# Altium project TE0890.PrjPCB
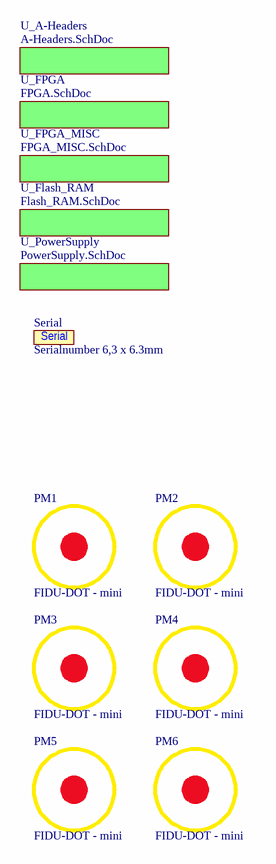
[diagram p0: TE0890.SchDoc]
ProjectName: TE0890; Revision: 01
6 sheets, 94 parts. Net scope: global (net labels, ports and power ports of the same name join across sheets).
Board file: TE0890.PcbDoc
Sheets:
  TE0890.SchDoc
    U_A-Headers = A-Headers.SchDoc
    U_PowerSupply = PowerSupply.SchDoc
    U_FPGA = FPGA.SchDoc
    U_FPGA_MISC = FPGA_MISC.SchDoc
    U_Flash_RAM = Flash_RAM.SchDoc

## Sheet TE0890.SchDoc: TE0890 - S7Mini
size A4; Organization: Trenz Electronic GmbH; DocumentNumber: TE0890; Revision: 01; SheetNumber: 1; SheetTotal: 6; Date: 2018-08-06; Author: Vitali Tsiukala; CompanyName: Trenz Electronic GmbH; DrawnBy: Vitali Tsiukala; Engineer: Vitali Tsiukala; ProjectName: TE0723 Arduino

### Parts
PM1  FIDU-DOT - mini  [FIDU-DOT - mini]
PM2  FIDU-DOT - mini  [FIDU-DOT - mini]
PM3  FIDU-DOT - mini  [FIDU-DOT - mini]
PM4  FIDU-DOT - mini  [FIDU-DOT - mini]
PM5  FIDU-DOT - mini  [FIDU-DOT - mini]
PM6  FIDU-DOT - mini  [FIDU-DOT - mini]
Serial  Serialnumber 6,3 x 6.3mm  [Serial_6.3x6.3mm]  (no BOM)

### Sub-sheets
U_A-Headers = A-Headers.SchDoc: no entries
U_Flash_RAM = Flash_RAM.SchDoc: no entries
U_FPGA = FPGA.SchDoc: no entries
U_FPGA_MISC = FPGA_MISC.SchDoc: no entries
U_PowerSupply = PowerSupply.SchDoc: no entries

### Notes on the sheet
- Title:
- Number:
- Rev.
- Date:
- A4
- Copyright:
- Page
- of
- Filename:

### Library data of the parts
PM1-PM6 = 27037: FIDU-DOT - MINI 0.5mm; AN: 27037; Mixed: FIDU
Serial = 26753: AN: 26753; H-ART: 39068; Mixed: MECH

## Sheet A-Headers.SchDoc: TE0890 - S7Mini
size A4; Organization: Trenz Electronic GmbH; DocumentNumber: TE0890; Revision: 01; SheetNumber: 2; SheetTotal: 6; Date: 2018-08-06; Author: Vitali Tsiukala; CompanyName: Trenz Electronic GmbH; DrawnBy: Vitali Tsiukala; Engineer: Vitali Tsiukala; ProjectName: TE0723 Arduino
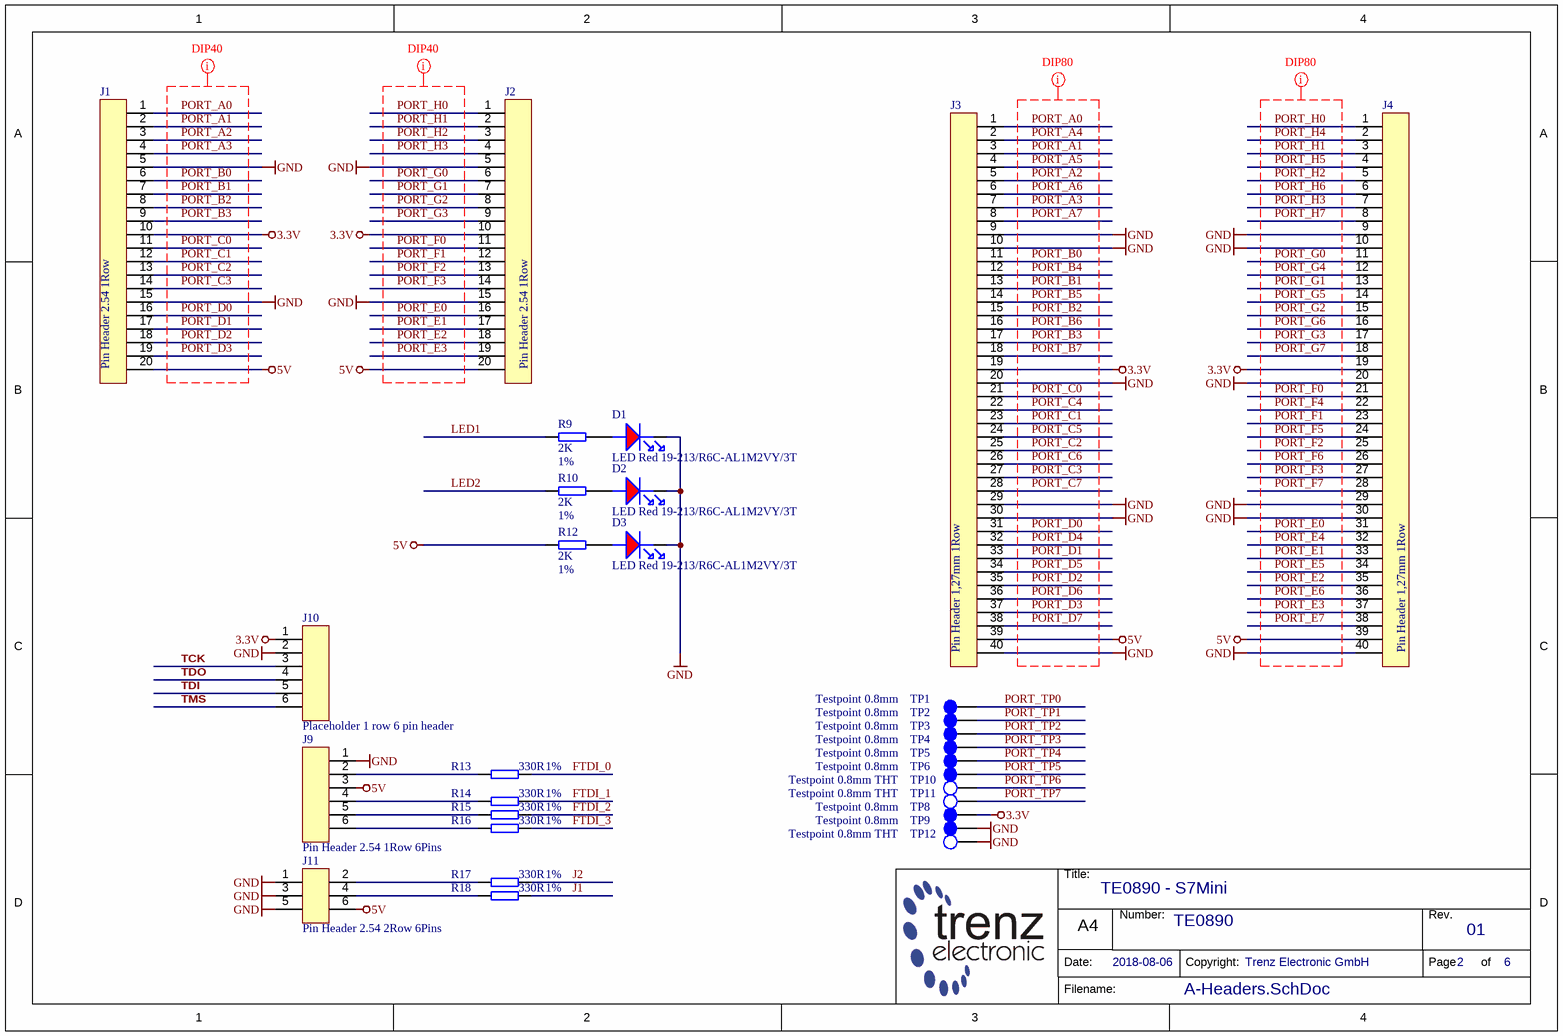
[diagram p1: A-Headers.SchDoc]

### Parts
D1  LED Red 19-213/R6C-AL1M2VY/3T  [LEDC1608X55N_RED]
D2  LED Red 19-213/R6C-AL1M2VY/3T  [LEDC1608X55N_RED]
D3  LED Red 19-213/R6C-AL1M2VY/3T  [LEDC1608X55N_RED]
J1  Pin Header 2.54 1Row  [STIFTLEISTE2_54 OG 1R-20]
J2  Pin Header 2.54 1Row  [STIFTLEISTE2_54 OG 1R-20]
J3  Pin Header 1,27mm 1Row  [STIFTLEISTE1_27 OG 1R-40]
J4  Pin Header 1,27mm 1Row  [STIFTLEISTE1_27 OG 1R-40]
J9  Pin Header 2.54 1Row 6Pins  [STIFTLEISTE2_54 OG 1R-6]
J10  Placeholder 1 row 6 pin header  [STIFTLEISTE2_54 OG 1R-6V]
J11  Pin Header 2.54 2Row 6Pins  [STIFTLEISTE2_54 OG 2R-6]
R9  2K  Tolerance: 1%  [RESC1005X40N]
R10  2K  Tolerance: 1%  [RESC1005X40N]
R12  2K  Tolerance: 1%  [RESC1005X40N]
R13  330R  Tolerance: 1%  [RESC1005X40N]
R14  330R  Tolerance: 1%  [RESC1005X40N]
R15  330R  Tolerance: 1%  [RESC1005X40N]
R16  330R  Tolerance: 1%  [RESC1005X40N]
R17  330R  Tolerance: 1%  [RESC1005X40N]
R18  330R  Tolerance: 1%  [RESC1005X40N]
TP1  Testpoint 0.8mm  [TP_0.8mm]
TP2  Testpoint 0.8mm  [TP_0.8mm]
TP3  Testpoint 0.8mm  [TP_0.8mm]
TP4  Testpoint 0.8mm  [TP_0.8mm]
TP5  Testpoint 0.8mm  [TP_0.8mm]
TP6  Testpoint 0.8mm  [TP_0.8mm]
TP8  Testpoint 0.8mm  [TP_0.8mm]
TP9  Testpoint 0.8mm  [TP_0.8mm]
TP10  Testpoint 0.8mm THT  [TP_0.8mm_THT]
TP11  Testpoint 0.8mm THT  [TP_0.8mm_THT]
TP12  Testpoint 0.8mm THT  [TP_0.8mm_THT]

### Nets
3.3V: J1.10 J2.10 J3.19 J4.19 J10.1 TP8.1
5V: J1.20 J2.20 J3.39 J4.39 J9.3 J11.6 R12.1
GND: D1.K D2.K D3.K J1.5 J1.15 J2.5 J2.15 J3.9 J3.10 J3.20 J3.29 J3.30 J3.40 J4.9 J4.10 J4.20 J4.29 J4.30 J4.40 J9.1 J10.2 J11.1 J11.3 J11.5 TP9.1 TP12.1
FTDI_0: R13.2
FTDI_1: R14.2
FTDI_2: R15.2
FTDI_3: R16.2
J1: R18.2
J2: R17.2
LED1: R9.1
LED2: R10.1
PORT_A0: J1.1 J3.1
PORT_A1: J1.2 J3.3
PORT_A2: J1.3 J3.5
PORT_A3: J1.4 J3.7
PORT_A4: J3.2
PORT_A5: J3.4
PORT_A6: J3.6
PORT_A7: J3.8
PORT_B0: J1.6 J3.11
PORT_B1: J1.7 J3.13
PORT_B2: J1.8 J3.15
PORT_B3: J1.9 J3.17
PORT_B4: J3.12
PORT_B5: J3.14
PORT_B6: J3.16
PORT_B7: J3.18
PORT_C0: J1.11 J3.21
PORT_C1: J1.12 J3.23
PORT_C2: J1.13 J3.25
PORT_C3: J1.14 J3.27
PORT_C4: J3.22
PORT_C5: J3.24
PORT_C6: J3.26
PORT_C7: J3.28
PORT_D0: J1.16 J3.31
PORT_D1: J1.17 J3.33
PORT_D2: J1.18 J3.35
PORT_D3: J1.19 J3.37
PORT_D4: J3.32
PORT_D5: J3.34
PORT_D6: J3.36
PORT_D7: J3.38
PORT_E0: J2.16 J4.31
PORT_E1: J2.17 J4.33
PORT_E2: J2.18 J4.35
PORT_E3: J2.19 J4.37
PORT_E4: J4.32
PORT_E5: J4.34
PORT_E6: J4.36
PORT_E7: J4.38
PORT_F0: J2.11 J4.21
PORT_F1: J2.12 J4.23
PORT_F2: J2.13 J4.25
PORT_F3: J2.14 J4.27
PORT_F4: J4.22
PORT_F5: J4.24
PORT_F6: J4.26
PORT_F7: J4.28
PORT_G0: J2.6 J4.11
PORT_G1: J2.7 J4.13
PORT_G2: J2.8 J4.15
PORT_G3: J2.9 J4.17
PORT_G4: J4.12
PORT_G5: J4.14
PORT_G6: J4.16
PORT_G7: J4.18
PORT_H0: J2.1 J4.1
PORT_H1: J2.2 J4.3
PORT_H2: J2.3 J4.5
PORT_H3: J2.4 J4.7
PORT_H4: J4.2
PORT_H5: J4.4
PORT_H6: J4.6
PORT_H7: J4.8
PORT_TP0: TP1.1
PORT_TP1: TP2.1
PORT_TP2: TP3.1
PORT_TP3: TP4.1
PORT_TP4: TP5.1
PORT_TP5: TP6.1
PORT_TP6: TP10.1
PORT_TP7: TP11.1
TCK: J10.3
TDI: J10.5
TDO: J10.4
TMS: J10.6
NetD1_A: D1.A R9.2
NetD2_A: D2.A R10.2
NetD3_A: D3.A R12.2
NetJ9_2: J9.2 R13.1
NetJ9_4: J9.4 R14.1
NetJ9_5: J9.5 R15.1
NetJ9_6: J9.6 R16.1
NetJ11_2: J11.2 R17.1
NetJ11_4: J11.4 R18.1

### Layout directives
net class DIP40: PORT_A0, PORT_A1, PORT_A2, PORT_A3, PORT_B0, PORT_B1, PORT_B2, PORT_B3, PORT_C0, PORT_C1, PORT_C2, PORT_C3, PORT_D0, PORT_D1, PORT_D2, PORT_D3, PORT_E0, PORT_E1, PORT_E2, PORT_E3, PORT_F0, PORT_F1, PORT_F2, PORT_F3, PORT_G0, PORT_G1, PORT_G2, PORT_G3, PORT_H0, PORT_H1, PORT_H2, PORT_H3
net class DIP80: PORT_A0, PORT_A1, PORT_A2, PORT_A3, PORT_A4, PORT_A5, PORT_A6, PORT_A7, PORT_B0, PORT_B1, PORT_B2, PORT_B3, PORT_B4, PORT_B5, PORT_B6, PORT_B7, PORT_C0, PORT_C1, PORT_C2, PORT_C3, PORT_C4, PORT_C5, PORT_C6, PORT_C7, PORT_D0, PORT_D1, PORT_D2, PORT_D3, PORT_D4, PORT_D5, PORT_D6, PORT_D7, PORT_E0, PORT_E1, PORT_E2, PORT_E3, PORT_E4, PORT_E5, PORT_E6, PORT_E7, PORT_F0, PORT_F1, PORT_F2, PORT_F3, PORT_F4, PORT_F5, PORT_F6, PORT_F7, PORT_G0, PORT_G1, PORT_G2, PORT_G3, PORT_G4, PORT_G5, PORT_G6, PORT_G7, PORT_H0, PORT_H1, PORT_H2, PORT_H3, PORT_H4, PORT_H5, PORT_H6, PORT_H7

### Notes on the sheet
- Title:
- Number:
- Rev.
- Date:
- A4
- Copyright:
- Page
- of
- Filename:

### Library data of the parts
D1-D3 = 28261: Chip LED 0603 Briliant Red; AN: 28261; Mixed: SMT; Case: 1608 (0603); HelpURL: b:\AD\adlib\datasheet\19-213-R6C\; H-ART: 19-213/R6C-AL1M2VY/3T
J1 J2 = 29193: Stiftleiste versetzt 1-reihig, 20pol.; AN: 29193; Mixed: THT; H-ART: 943-12-020-00; Temperature-Range: -40/+125; HelpURL: b:\AD\adlib\datasheet\W+P_943_944_945\
J3 J4 = 29194: Stiftleiste versetzt 1-reihig, 40pol.; AN: 29194; Mixed: THT; Temperature-Range: -40/+125; H-ART: 702-40-40-00; HelpURL: b:\AD\adlib\datasheet\W+P_702_703\
J9 = 28042: Stiftleiste gerade 1-reihig, 6pol; AN: 28042; Mixed: THT
J10 = 22911: Stiftleiste versetzt 1-reihig, 6pol.; AN: 22911; Mixed: THT; Trenz-Stock: Yes
J11 = 22334: Stiftleiste gerade 2-reihig, 6pol.; AN: 22334; Mixed: THT; Trenz-Stock: Yes
R9 R10 R12 = 25073: WID SMD 2K 1% 0,063W; AN: 25073; Mixed: SMT; H-ART: RC0402FR-072KL; Case: 1005 (0402); Technology: TK100; Value: 2K
R13-R18 = 22762: WID SMD 330R 1% 0,063W  BF 1005 (0402); AN: 22762; Mixed: SMT; Value: 330; Preferred: Yes; H-ART: RC0402FR-13330RL; Case: 1005 (0402); Technology: TK100
TP1-TP6 TP8 TP9 = 26289: AN: 26289; Mixed: MECH
TP10-TP12 = 27481: Testpoint 0.8mm TH; AN: 27481

## Sheet PowerSupply.SchDoc: TE0890 - S7Mini
size A4; PageSetup: Record=PageOptions|CenterHorizontal=True|CenterVertical=True|PrintScale=0.96|XCorrection=1.00|YCorrection=1.00|PrintKind=0|BorderSize=5000000|LeftOffset=0|BottomOffset=0|Orientation=2|PaperLength=1000|PaperWidth=1000|Scale=100|PaperSource=7|PrintQuality=-4|MediaType=1|DitherType=10|PaperKind=A4|PrintScaleMode=1; Organization: Trenz Electronic GmbH; DocumentNumber: TE0890; Revision: 01; SheetNumber: 6; SheetTotal: 6; Date: 2018-08-06; Author: Vitali Tsiukala; CompanyName: Trenz Electronic GmbH; DrawnBy: Vitali Tsiukala; Engineer: Vitali Tsiukala; ProjectName: TE0723 Arduino
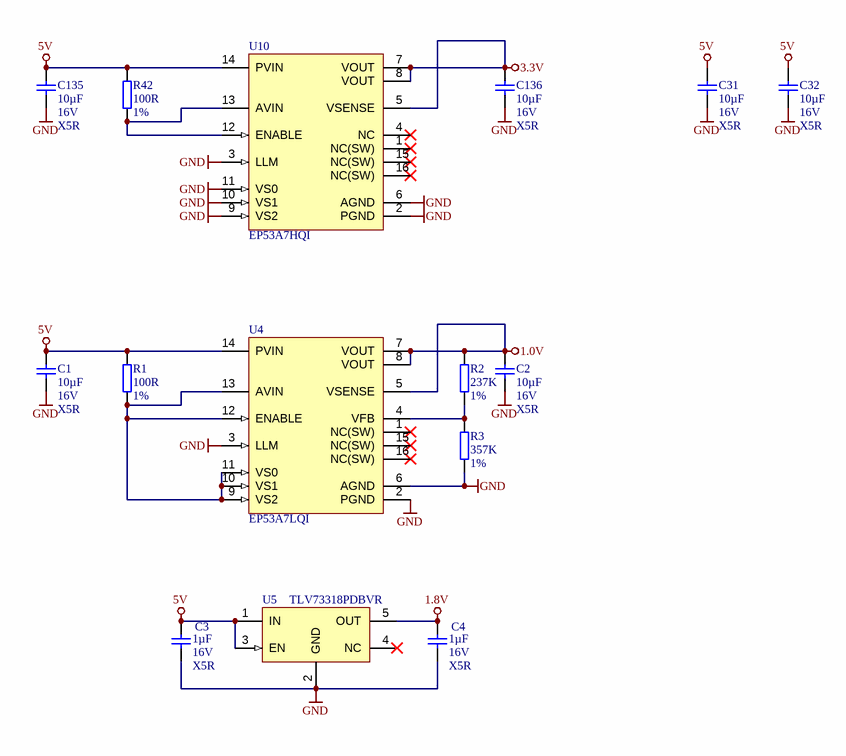
[diagram p2: PowerSupply.SchDoc]

### Parts
C1  10µF  Voltage: 16V  Technology: X5R  [CAPC1608X90N]
C2  10µF  Voltage: 16V  Technology: X5R  [CAPC1608X90N]
C3  1µF  Voltage: 16V  Technology: X5R  [CAPC1005X55N]
C4  1µF  Voltage: 16V  Technology: X5R  [CAPC1005X55N]
C31  10µF  Voltage: 16V  Technology: X5R  [CAPC1608X90N]
C32  10µF  Voltage: 16V  Technology: X5R  [CAPC1608X90N]
C135  10µF  Voltage: 16V  Technology: X5R  [CAPC1608X90N]
C136  10µF  Voltage: 16V  Technology: X5R  [CAPC1608X90N]
R1  100R  Tolerance: 1%  [RESC1005X40N]
R2  237K  Tolerance: 1%  [RESC1005X40N]
R3  357K  Tolerance: 1%  [RESC1005X40N]
R42  100R  Tolerance: 1%  [RESC1005X40N]
U4  EP53A7LQI  [EP53F8QI]
U5  TLV73318PDBVR  [SOT95P280X145-5N]
U10  EP53A7HQI  [EP53F8QI]

### Nets
1.0V: C2.2 R2.1 U4.5(VSENSE) U4.7(VOUT) U4.8(VOUT)
1.8V: C4.1 U5.5(OUT)
3.3V: C136.2 U10.5(VSENSE) U10.7(VOUT) U10.8(VOUT)
5V: C1.2 C3.1 C31.2 C32.2 C135.2 R1.1 R42.1 U4.14(PVIN) U5.1(IN) U5.3(EN) U10.14(PVIN)
GND: C1.1 C2.1 C3.2 C4.2 C31.1 C32.1 C135.1 C136.1 R3.2 U4.2(PGND) U4.3(LLM) U4.6(AGND) U5.2(GND) U10.2(PGND) U10.3(LLM) U10.6(AGND) U10.9(VS2) U10.10(VS1) U10.11(VS0)
NetR1_2: R1.2 U4.9(VS2) U4.10(VS1) U4.11(VS0) U4.12(ENABLE) U4.13(AVIN)
NetR2_2: R2.2 R3.1 U4.4(VFB)
NetR42_2: R42.2 U10.12(ENABLE) U10.13(AVIN)

Not connected (* = marked no-connect by the designer): U4 1(NC(SW))* 15(NC(SW))* 16(NC(SW))*; U5 4(NC)*; U10 1(NC(SW))* 4(NC)* 15(NC(SW))* 16(NC(SW))*

### Notes on the sheet
- Title:
- Number:
- Rev.
- Date:
- A4
- Copyright:
- Page
- of
- Filename:

### Library data of the parts
C1 C2 C31 C32 C135 C136 = 25341: KON 10µF 16V X5R 20% SMD BF 1608 (0603); AN: 25341; Value: 10u; Mixed: SMT; Preferred: Yes; Temperature-Range: -55/+85; Case: 1608 (0603); Tolerance: 20%
C3 C4 = 26579: KON 1µF 16V X5R 10% SMD BF 1005 (0402); AN: 26579; Mixed: SMT; Value: 1u; Temperature-Range: -55/+85; Case: 1005 (0402); Tolerance: 10%
R1 R42 = 22507: WID SMD 100R 1% 0,063W  BF 1005 (0402); AN: 22507; Mixed: SMT; Value: 100; Preferred: Yes; H-ART: RC0402FR-13100RL; Case: 1005 (0402); Technology: TK100
R2 = 24549: WID SMD 237K 1% 0,063W; AN: 24549; Mixed: SMT; Preferred: Yes; H-ART: RC0402FR-07237KL; Case: 1005 (0402); Technology: TK100; Value: 237K
R3 = 25437: WID SMD 357K 1% 0,063W; AN: 25437; Mixed: SMT; Preferred: Yes; Case: 1005 (0402); Technology: TK100; Value: 357k
U4 = 28280: AN: 28280; Mixed: SMT; Trenz-Stock: Yes; Case: QFN16; HelpURL: B:\AD\adlib\datasheet\EP53A7HQI; H-ART: EP53A7LQI; Preferred: Yes
U5 = 28418: TLV73318PDBV; AN: 28418; Voltage: 1.8V; Mixed: SMT; Case: SOT23-3; HelpURL: b:\AD\adlib\datasheet\TLV733xx\; H-ART: TLV73318PDBV
U10 = 27996: AN: 27996; Mixed: SMT; Trenz-Stock: Yes; Case: QFN16; HelpURL: B:\AD\adlib\datasheet\EP53A7HQI; Preferred: Yes; H-ART: EP53A7HQI

## Sheet FPGA.SchDoc: TE0890 - S7Mini
size A4; Organization: Trenz Electronic GmbH; DocumentNumber: TE0890; Revision: 01; SheetNumber: 3; SheetTotal: 6; Date: 2018-08-06; Author: Vitali Tsiukala; CompanyName: Trenz Electronic GmbH; DrawnBy: Vitali Tsiukala; Engineer: Vitali Tsiukala; ProjectName: TE0723 Arduino
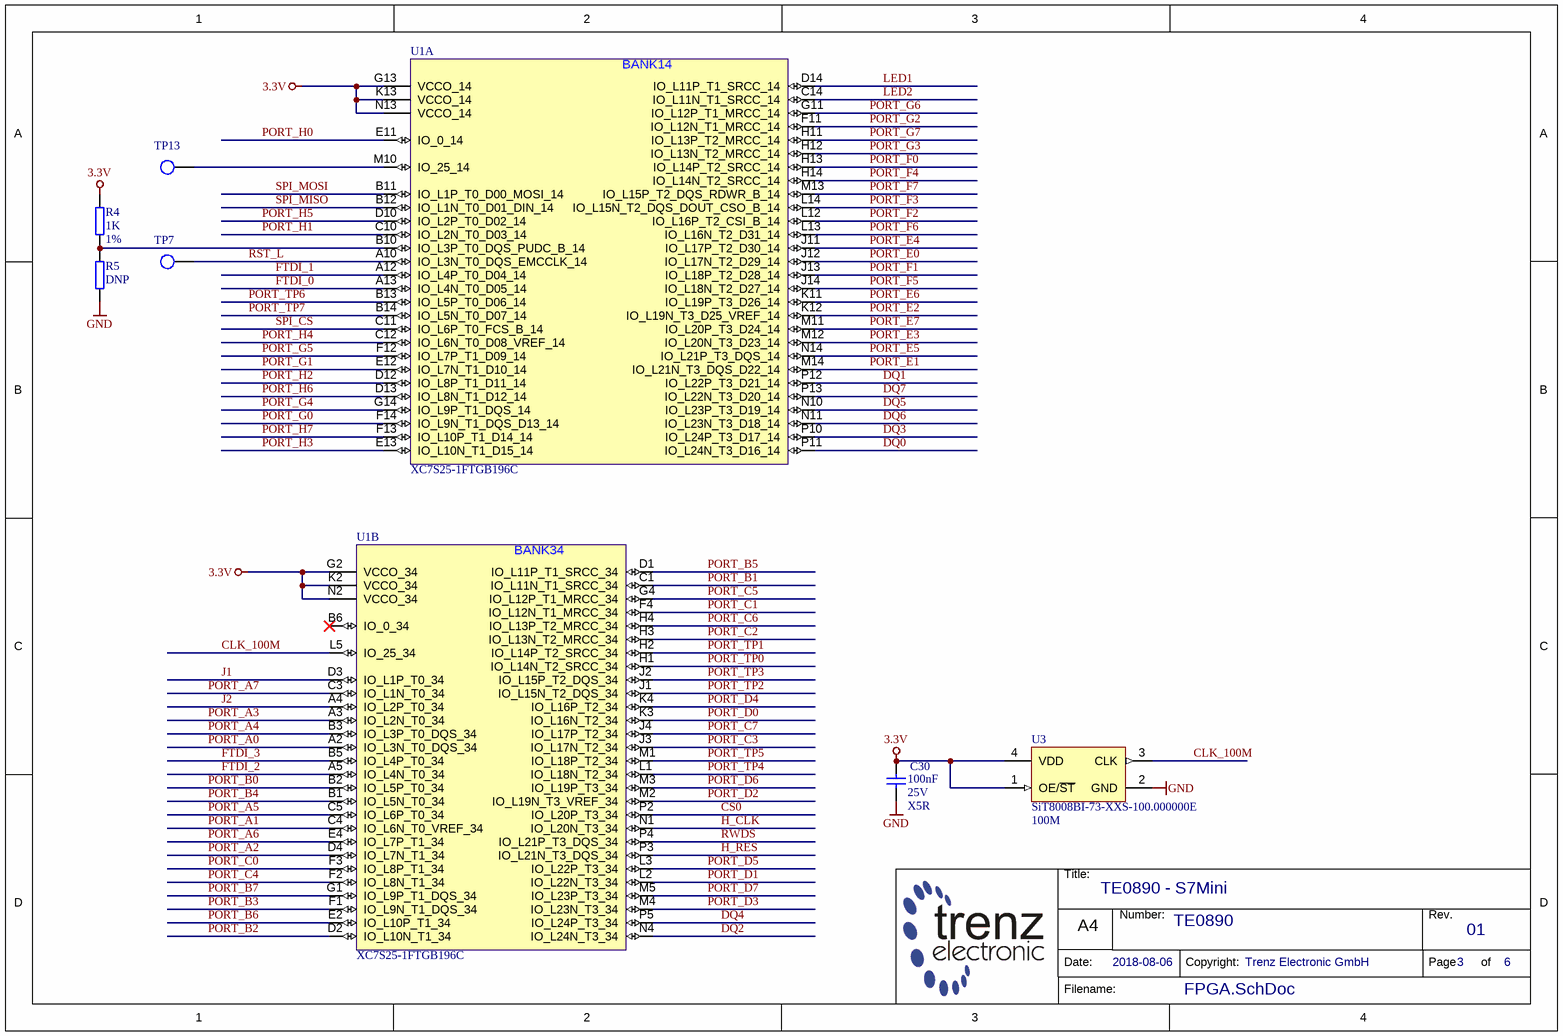
[diagram p3: FPGA.SchDoc]

### Parts
C30  100nF  Voltage: 25V  Technology: X5R  [CAPC1005X55N]
R4  1K  Tolerance: 1%  [RESC1005X40N]
R5  DNP  [RESC1005X40N]  (no BOM)
TP7  Testpoint 0.8mm THT  [TP_0.8mm_THT]  (value not drawn)
TP13  Testpoint 0.8mm THT  [TP_0.8mm_THT]  (value not drawn)
U1  XC7S25-1FTGB196C  [BGA196C100P14X14_1500X1500X155B50N]  (parts A,B of 5)
U3  SiT8008BI-73-XXS-100.000000E  value 100M  [2016]

### Nets
3.3V: C30.1 R4.1 U1.G2(VCCO_34) U1.G13(VCCO_14) U1.K2(VCCO_34) U1.K13(VCCO_14) U1.N2(VCCO_34) U1.N13(VCCO_14) U3.1(OE/~{ST}) U3.4(VDD)
GND: C30.2 R5.2 U3.2(GND)
CLK_100M: U1.L5(IO_25_34) U3.3(CLK)
CS0: U1.P2(IO_L20P_T3_34)
DQ0: U1.P11(IO_L24N_T3_D16_14)
DQ1: U1.P12(IO_L22P_T3_D21_14)
DQ2: U1.N4(IO_L24N_T3_34)
DQ3: U1.P10(IO_L24P_T3_D17_14)
DQ4: U1.P5(IO_L24P_T3_34)
DQ5: U1.N10(IO_L23P_T3_D19_14)
DQ6: U1.N11(IO_L23N_T3_D18_14)
DQ7: U1.P13(IO_L22N_T3_D20_14)
FTDI_0: U1.A13(IO_L4N_T0_D05_14)
FTDI_1: U1.A12(IO_L4P_T0_D04_14)
FTDI_2: U1.A5(IO_L4N_T0_34)
FTDI_3: U1.B5(IO_L4P_T0_34)
H_CLK: U1.N1(IO_L20N_T3_34)
H_RES: U1.P3(IO_L21N_T3_DQS_34)
J1: U1.D3(IO_L1P_T0_34)
J2: U1.A4(IO_L2P_T0_34)
LED1: U1.D14(IO_L11P_T1_SRCC_14)
LED2: U1.C14(IO_L11N_T1_SRCC_14)
PORT_A0: U1.A2(IO_L3N_T0_DQS_34)
PORT_A1: U1.C4(IO_L6N_T0_VREF_34)
PORT_A2: U1.D4(IO_L7N_T1_34)
PORT_A3: U1.A3(IO_L2N_T0_34)
PORT_A4: U1.B3(IO_L3P_T0_DQS_34)
PORT_A5: U1.C5(IO_L6P_T0_34)
PORT_A6: U1.E4(IO_L7P_T1_34)
PORT_A7: U1.C3(IO_L1N_T0_34)
PORT_B0: U1.B2(IO_L5P_T0_34)
PORT_B1: U1.C1(IO_L11N_T1_SRCC_34)
PORT_B2: U1.D2(IO_L10N_T1_34)
PORT_B3: U1.F1(IO_L9N_T1_DQS_34)
PORT_B4: U1.B1(IO_L5N_T0_34)
PORT_B5: U1.D1(IO_L11P_T1_SRCC_34)
PORT_B6: U1.E2(IO_L10P_T1_34)
PORT_B7: U1.G1(IO_L9P_T1_DQS_34)
PORT_C0: U1.F3(IO_L8P_T1_34)
PORT_C1: U1.F4(IO_L12N_T1_MRCC_34)
PORT_C2: U1.H3(IO_L13N_T2_MRCC_34)
PORT_C3: U1.J3(IO_L17N_T2_34)
PORT_C4: U1.F2(IO_L8N_T1_34)
PORT_C5: U1.G4(IO_L12P_T1_MRCC_34)
PORT_C6: U1.H4(IO_L13P_T2_MRCC_34)
PORT_C7: U1.J4(IO_L17P_T2_34)
PORT_D0: U1.K3(IO_L16N_T2_34)
PORT_D1: U1.L2(IO_L22N_T3_34)
PORT_D2: U1.M2(IO_L19N_T3_VREF_34)
PORT_D3: U1.M4(IO_L23N_T3_34)
PORT_D4: U1.K4(IO_L16P_T2_34)
PORT_D5: U1.L3(IO_L22P_T3_34)
PORT_D6: U1.M3(IO_L19P_T3_34)
PORT_D7: U1.M5(IO_L23P_T3_34)
PORT_E0: U1.J12(IO_L17N_T2_D29_14)
PORT_E1: U1.M14(IO_L21N_T3_DQS_D22_14)
PORT_E2: U1.K12(IO_L19N_T3_D25_VREF_14)
PORT_E3: U1.M12(IO_L20N_T3_D23_14)
PORT_E4: U1.J11(IO_L17P_T2_D30_14)
PORT_E5: U1.N14(IO_L21P_T3_DQS_14)
PORT_E6: U1.K11(IO_L19P_T3_D26_14)
PORT_E7: U1.M11(IO_L20P_T3_D24_14)
PORT_F0: U1.H13(IO_L14P_T2_SRCC_14)
PORT_F1: U1.J13(IO_L18P_T2_D28_14)
PORT_F2: U1.L12(IO_L16P_T2_CSI_B_14)
PORT_F3: U1.L14(IO_L15N_T2_DQS_DOUT_CSO_B_14)
PORT_F4: U1.H14(IO_L14N_T2_SRCC_14)
PORT_F5: U1.J14(IO_L18N_T2_D27_14)
PORT_F6: U1.L13(IO_L16N_T2_D31_14)
PORT_F7: U1.M13(IO_L15P_T2_DQS_RDWR_B_14)
PORT_G0: U1.F14(IO_L9N_T1_DQS_D13_14)
PORT_G1: U1.E12(IO_L7N_T1_D10_14)
PORT_G2: U1.F11(IO_L12N_T1_MRCC_14)
PORT_G3: U1.H12(IO_L13N_T2_MRCC_14)
PORT_G4: U1.G14(IO_L9P_T1_DQS_14)
PORT_G5: U1.F12(IO_L7P_T1_D09_14)
PORT_G6: U1.G11(IO_L12P_T1_MRCC_14)
PORT_G7: U1.H11(IO_L13P_T2_MRCC_14)
PORT_H0: U1.E11(IO_0_14)
PORT_H1: U1.C10(IO_L2N_T0_D03_14)
PORT_H2: U1.D12(IO_L8P_T1_D11_14)
PORT_H3: U1.E13(IO_L10N_T1_D15_14)
PORT_H4: U1.C12(IO_L6N_T0_D08_VREF_14)
PORT_H5: U1.D10(IO_L2P_T0_D02_14)
PORT_H6: U1.D13(IO_L8N_T1_D12_14)
PORT_H7: U1.F13(IO_L10P_T1_D14_14)
PORT_TP0: U1.H1(IO_L14N_T2_SRCC_34)
PORT_TP1: U1.H2(IO_L14P_T2_SRCC_34)
PORT_TP2: U1.J1(IO_L15N_T2_DQS_34)
PORT_TP3: U1.J2(IO_L15P_T2_DQS_34)
PORT_TP4: U1.L1(IO_L18N_T2_34)
PORT_TP5: U1.M1(IO_L18P_T2_34)
PORT_TP6: U1.B13(IO_L5P_T0_D06_14)
PORT_TP7: U1.B14(IO_L5N_T0_D07_14)
RST_L: TP7.1 U1.A10(IO_L3N_T0_DQS_EMCCLK_14)
RWDS: U1.P4(IO_L21P_T3_DQS_34)
SPI_CS: U1.C11(IO_L6P_T0_FCS_B_14)
SPI_MISO: U1.B12(IO_L1N_T0_D01_DIN_14)
SPI_MOSI: U1.B11(IO_L1P_T0_D00_MOSI_14)
NetR4_2: R4.2 R5.1 U1.B10(IO_L3P_T0_DQS_PUDC_B_14)
NetTP13_1: TP13.1 U1.M10(IO_25_14)

Not connected (* = marked no-connect by the designer): U1 B6(IO_0_34)*

### Notes on the sheet
- Title:
- Number:
- Rev.
- Date:
- A4
- Copyright:
- Page
- of
- Filename:
- (in symbol 29276, part A) BANK14
- (in symbol 29276, part B) BANK34

### Library data of the parts
C30 = 22472: KON 100nF 25V X5R ±10% SMD BF 1005 (0402); AN: 22472; Mixed: SMT; Value: 100n; Preferred: Yes; Temperature-Range: -55/+85; Case: 1005 (0402)
R4 = 22752: WID SMD 1K 1% 0,063W  BF 1005 (0402); AN: 22752; Mixed: SMT; Preferred: Yes; H-ART: RC0402FR-071KL; Case: 1005 (0402); Technology: TK100; Value: 1K
R5 = 29416: WID SMD BF 1005 (0402) DNP; AN: 29416; Case: 1005 (0402); Value: DNP
TP7 TP13 = 27481: Testpoint 0.8mm TH; AN: 27481
U1 = 29276: AN: 29276; Mixed: SMT; Temperature-Range: 0/+85; Case: FTGB196; HelpURL: B:\AD\adlib\datasheet\XC7; H-ART: XC7S25-1FTGB196C
U3 = 25961: SiT8008BI-73-XXS-100.000000E MEMS Oszillator 100MHz; AN: 25961; Mixed: SMT; Trenz-Stock: Yes; Case: 2.0  x 1.6mm; HelpURL: B:\AD\adlib\datasheet\SiT8008; Preferred: Yes; H-ART: SiT8008BI-73-XXS-100.000000E

## Sheet FPGA_MISC.SchDoc: TE0890 - S7Mini
size A4; Organization: Trenz Electronic GmbH; DocumentNumber: TE0890; Revision: 01; SheetNumber: 4; SheetTotal: 6; Date: 2018-08-06; Author: Vitali Tsiukala; CompanyName: Trenz Electronic GmbH; DrawnBy: Vitali Tsiukala; Engineer: Vitali Tsiukala; ProjectName: TE0723 Arduino
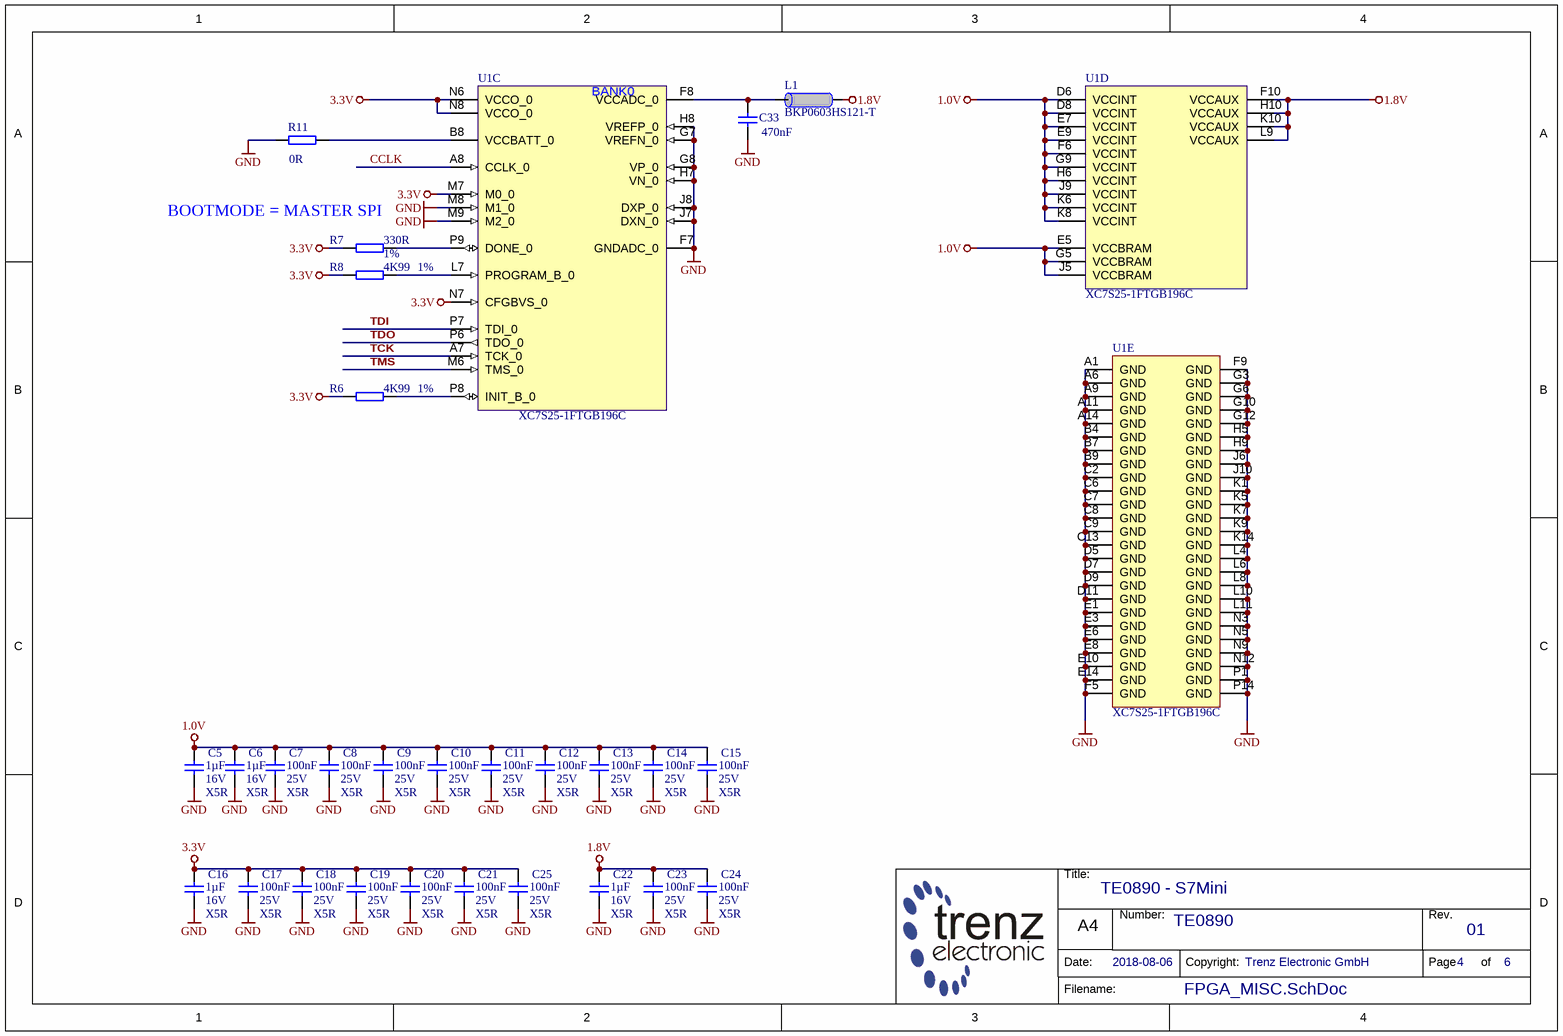
[diagram p4: FPGA_MISC.SchDoc]

### Parts
C5  1µF  Voltage: 16V  Technology: X5R  [CAPC1005X55N]
C6  1µF  Voltage: 16V  Technology: X5R  [CAPC1005X55N]
C7  100nF  Voltage: 25V  Technology: X5R  [CAPC1005X55N]
C8  100nF  Voltage: 25V  Technology: X5R  [CAPC1005X55N]
C9  100nF  Voltage: 25V  Technology: X5R  [CAPC1005X55N]
C10  100nF  Voltage: 25V  Technology: X5R  [CAPC1005X55N]
C11  100nF  Voltage: 25V  Technology: X5R  [CAPC1005X55N]
C12  100nF  Voltage: 25V  Technology: X5R  [CAPC1005X55N]
C13  100nF  Voltage: 25V  Technology: X5R  [CAPC1005X55N]
C14  100nF  Voltage: 25V  Technology: X5R  [CAPC1005X55N]
C15  100nF  Voltage: 25V  Technology: X5R  [CAPC1005X55N]
C16  1µF  Voltage: 16V  Technology: X5R  [CAPC1005X55N]
C17  100nF  Voltage: 25V  Technology: X5R  [CAPC1005X55N]
C18  100nF  Voltage: 25V  Technology: X5R  [CAPC1005X55N]
C19  100nF  Voltage: 25V  Technology: X5R  [CAPC1005X55N]
C20  100nF  Voltage: 25V  Technology: X5R  [CAPC1005X55N]
C21  100nF  Voltage: 25V  Technology: X5R  [CAPC1005X55N]
C22  1µF  Voltage: 16V  Technology: X5R  [CAPC1005X55N]
C23  100nF  Voltage: 25V  Technology: X5R  [CAPC1005X55N]
C24  100nF  Voltage: 25V  Technology: X5R  [CAPC1005X55N]
C25  100nF  Voltage: 25V  Technology: X5R  [CAPC1005X55N]
C33  470nF  [CAPC0603X33N]
L1  BKP0603HS121-T  [INDC0603X33N]
R6  4K99  Tolerance: 1%  [RESC1005X40N]
R7  330R  Tolerance: 1%  [RESC1005X40N]
R8  4K99  Tolerance: 1%  [RESC1005X40N]
R11  0R  [RESC1005X40N]
U1  XC7S25-1FTGB196C  [BGA196C100P14X14_1500X1500X155B50N]  (parts C,D,E of 5)

### Nets
1.0V: C5.1 C6.1 C7.1 C8.1 C9.1 C10.1 C11.1 C12.1 C13.1 C14.1 C15.1 U1.D6(VCCINT) U1.D8(VCCINT) U1.E5(VCCBRAM) U1.E7(VCCINT) U1.E9(VCCINT) U1.F6(VCCINT) U1.G5(VCCBRAM) U1.G9(VCCINT) U1.H6(VCCINT) U1.J5(VCCBRAM) U1.J9(VCCINT) U1.K6(VCCINT) U1.K8(VCCINT)
1.8V: C22.1 C23.1 C24.1 L1.1 U1.F10(VCCAUX) U1.H10(VCCAUX) U1.K10(VCCAUX) U1.L9(VCCAUX)
3.3V: C16.1 C17.1 C18.1 C19.1 C20.1 C21.1 C25.1 R6.1 R7.1 R8.1 U1.M7(M0_0) U1.N6(VCCO_0) U1.N7(CFGBVS_0) U1.N8(VCCO_0)
GND: C5.2 C6.2 C7.2 C8.2 C9.2 C10.2 C11.2 C12.2 C13.2 C14.2 C15.2 C16.2 C17.2 C18.2 C19.2 C20.2 C21.2 C22.2 C23.2 C24.2 C25.2 C33.2 R11.1 U1.A1(GND) U1.A6(GND) U1.A9(GND) U1.A11(GND) U1.A14(GND) U1.B4(GND) U1.B7(GND) U1.B9(GND) U1.C2(GND) U1.C6(GND) U1.C7(GND) U1.C8(GND) U1.C9(GND) U1.C13(GND) U1.D5(GND) U1.D7(GND) U1.D9(GND) U1.D11(GND) U1.E1(GND) U1.E3(GND) U1.E6(GND) U1.E8(GND) U1.E10(GND) U1.E14(GND) U1.F5(GND) U1.F7(GNDADC_0) U1.F9(GND) U1.G3(GND) U1.G6(GND) U1.G7(VREFN_0) U1.G8(VP_0) U1.G10(GND) U1.G12(GND) U1.H5(GND) U1.H7(VN_0) U1.H8(VREFP_0) U1.H9(GND) U1.J6(GND) U1.J7(DXN_0) U1.J8(DXP_0) U1.J10(GND) U1.K1(GND) U1.K5(GND) U1.K7(GND) U1.K9(GND) U1.K14(GND) U1.L4(GND) U1.L6(GND) U1.L8(GND) U1.L10(GND) U1.L11(GND) U1.M8(M1_0) U1.M9(M2_0) U1.N3(GND) U1.N5(GND) U1.N9(GND) U1.N12(GND) U1.P1(GND) U1.P14(GND)
CCLK: U1.A8(CCLK_0)
TCK: U1.A7(TCK_0)
TDI: U1.P7(TDI_0)
TDO: U1.P6(TDO_0)
TMS: U1.M6(TMS_0)
NetC33_1: C33.1 L1.2 U1.F8(VCCADC_0)
NetR6_2: R6.2 U1.P8(INIT_B_0)
NetR7_2: R7.2 U1.P9(DONE_0)
NetR8_2: R8.2 U1.L7(PROGRAM_B_0)
NetR11_2: R11.2 U1.B8(VCCBATT_0)

### Notes on the sheet
- (near R7) BOOTMODE = MASTER SPI
- Title:
- Number:
- Rev.
- Date:
- A4
- Copyright:
- Page
- of
- Filename:
- (in symbol 29276, part C) BANK0

### Library data of the parts
C5 C6 C16 C22 = 26579: as C3 on sheet PowerSupply; Case: 1005 (0402); Tolerance: 10%
C7-C15 C17-C21 C23-C25 = 22472: as C30 on sheet FPGA; Case: 1005 (0402)
C33 = 24921: KON 470nF 6.3V X5R 20%  SMD BF 0603 (0201); AN: 24921; Value: 470n; Mixed: SMT; Preferred: Yes; Temperature-Range: -55/+85; Case: 0603 (0201); Voltage: 6.3V; Technology: X5R; Tolerance: 20%
L1 = 25393: Ferritdurchführung SMD 0201, BKP0603HS121-T; AN: 25393; Mixed: SMT; Preferred: Yes; Tolerance: 25%; Temperature-Range: -55/+85; Case: 0603 (0201); HelpURL: B:\AD\adlib\datasheet\MULTILAYER CHIP BEAD INDUCTORS BK; Trenz-Stock: Yes; H-ART: BKP0603HS121-T
R6 R8 = 22754: WID SMD 4K99 1% 0,063W; AN: 22754; Value: 4.99K; Mixed: SMT; Preferred: Yes; H-ART: RC0402FR-074K99L; Case: 1005 (0402); Technology: TK100
R7 = 22762: WID SMD 330R 1% 0,063W  BF 1005 (0402); AN: 22762; Value: 330; Mixed: SMT; Preferred: Yes; H-ART: RC0402FR-13330RL; Case: 1005 (0402); Technology: TK100
R11 = 22738: WID SMD 0R; AN: 22738; Mixed: SMT; Value: 0; Preferred: Yes; Tolerance: 1%; H-ART: RC0402JR-070RL; Case: 1005 (0402); Technology: TK100
U1 = 29276: as U1 on sheet FPGA; Case: FTGB196; HelpURL: B:\AD\adlib\datasheet\XC7; H-ART: XC7S25-1FTGB196C

## Sheet Flash_RAM.SchDoc: TE0890 - S7Mini
size A4; Organization: Trenz Electronic GmbH; DocumentNumber: TE0890; Revision: 01; SheetNumber: 5; SheetTotal: 6; Date: 2018-08-06; Author: Vitali Tsiukala; CompanyName: Trenz Electronic GmbH; DrawnBy: Vitali Tsiukala; Engineer: Vitali Tsiukala; ProjectName: TE0723 Arduino
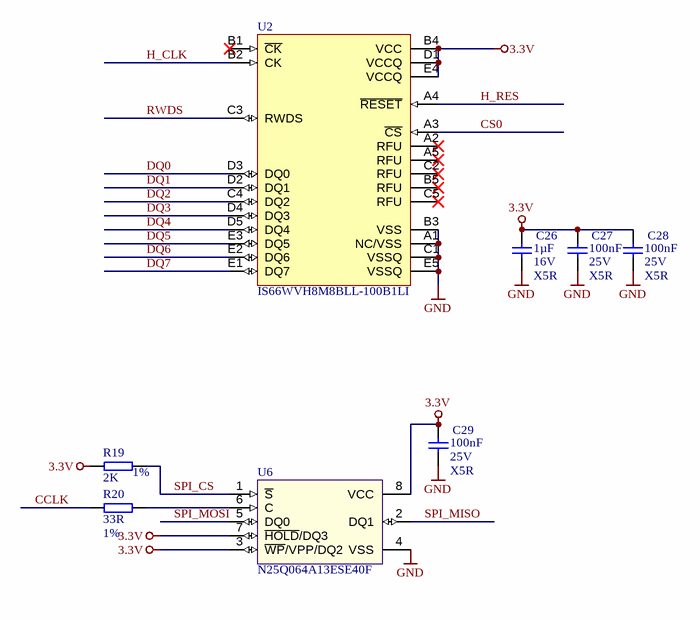
[diagram p5: Flash_RAM.SchDoc]

### Parts
C26  1µF  Voltage: 16V  Technology: X5R  [CAPC1005X55N]
C27  100nF  Voltage: 25V  Technology: X5R  [CAPC1005X55N]
C28  100nF  Voltage: 25V  Technology: X5R  [CAPC1005X55N]
C29  100nF  Voltage: 25V  Technology: X5R  [CAPC1005X55N]
R19  2K  Tolerance: 1%  [RESC1005X40N]
R20  33R  Tolerance: 1%  [RESC1005X40N]
U2  IS66WVH8M8BLL-100B1LI  [BGA25C100P5X5_800X600X120N]
U6  N25Q064A13ESE40F  [SOIC127P790X191-8N]

### Nets
3.3V: C26.1 C27.1 C28.1 C29.1 R19.1 U2.B4(VCC) U2.D1(VCCQ) U2.E4(VCCQ) U6.3(~{WP}/VPP/DQ2) U6.7(~{HOLD}/DQ3) U6.8(VCC)
GND: C26.2 C27.2 C28.2 C29.2 U2.A1(NC/VSS) U2.B3(VSS) U2.C1(VSSQ) U2.E5(VSSQ) U6.4(VSS)
CCLK: R20.1
CS0: U2.A3(~{CS})
DQ0: U2.D3(DQ0)
DQ1: U2.D2(DQ1)
DQ2: U2.C4(DQ2)
DQ3: U2.D4(DQ3)
DQ4: U2.D5(DQ4)
DQ5: U2.E3(DQ5)
DQ6: U2.E2(DQ6)
DQ7: U2.E1(DQ7)
H_CLK: U2.B2(CK)
H_RES: U2.A4(~{RESET})
RWDS: U2.C3(RWDS)
SPI_CS: R19.2 U6.1(~{S})
SPI_MISO: U6.2(DQ1)
SPI_MOSI: U6.5(DQ0)
NetR20_2: R20.2 U6.6(C)

Not connected (* = marked no-connect by the designer): U2 A2(RFU)* A5(RFU)* B1(~{CK})* B5(RFU)* C2(RFU)* C5(RFU)*

### Notes on the sheet
- Title:
- Number:
- Rev.
- Date:
- A4
- Copyright:
- Page
- of
- Filename:

### Library data of the parts
C26 = 26579: as C3 on sheet PowerSupply; Case: 1005 (0402); Tolerance: 10%
C27-C29 = 22472: as C30 on sheet FPGA; Case: 1005 (0402)
R19 = 25073: as R9 on sheet A-Headers; Case: 1005 (0402); Technology: TK100; Value: 2K
R20 = 22770: WID SMD 33R 1% 0,063W BF 1005 (0402); AN: 22770; Mixed: SMT; Value: 33; Preferred: Yes; H-ART: RC0402FR-0733RL; Case: 1005 (0402); Technology: TK100
U2 = 29136: AN: 29136; Mixed: SMT; Temperature-Range: -40/+85; Case: BGA25; HelpURL: b:\AD\adlib\datasheet\IS6xWVH8M8\; H-ART: IS66WVH8M8BLL-100B1LI
U6 = 25582: N25Q064A13ESE40 64MBit Serial Flash; AN: 25582; Mixed: SMT; Case: SO8W 208-mil (SS); HelpURL: B:\AD\adlib\datasheet\N25Q064A; H-ART: N25Q064A13ESE40F

## Nets that join several sheets
1.0V: PowerSupply (5 pins), FPGA_MISC (24 pins)
1.8V: PowerSupply (C4.1 U5.5), FPGA_MISC (8 pins)
3.3V: A-Headers (6 pins), PowerSupply (C136.2 U10.5 U10.7 U10.8), FPGA (10 pins), FPGA_MISC (14 pins), Flash_RAM (11 pins)
5V: A-Headers (7 pins), PowerSupply (11 pins)
GND: A-Headers (26 pins), PowerSupply (19 pins), FPGA (C30.2 R5.2 U3.2), FPGA_MISC (82 pins), Flash_RAM (9 pins)
CCLK: FPGA_MISC (U1.A8), Flash_RAM (R20.1)
CS0: FPGA (U1.P2), Flash_RAM (U2.A3)
DQ0: FPGA (U1.P11), Flash_RAM (U2.D3)
DQ1: FPGA (U1.P12), Flash_RAM (U2.D2)
DQ2: FPGA (U1.N4), Flash_RAM (U2.C4)
DQ3: FPGA (U1.P10), Flash_RAM (U2.D4)
DQ4: FPGA (U1.P5), Flash_RAM (U2.D5)
DQ5: FPGA (U1.N10), Flash_RAM (U2.E3)
DQ6: FPGA (U1.N11), Flash_RAM (U2.E2)
DQ7: FPGA (U1.P13), Flash_RAM (U2.E1)
FTDI_0: A-Headers (R13.2), FPGA (U1.A13)
FTDI_1: A-Headers (R14.2), FPGA (U1.A12)
FTDI_2: A-Headers (R15.2), FPGA (U1.A5)
FTDI_3: A-Headers (R16.2), FPGA (U1.B5)
H_CLK: FPGA (U1.N1), Flash_RAM (U2.B2)
H_RES: FPGA (U1.P3), Flash_RAM (U2.A4)
J1: A-Headers (R18.2), FPGA (U1.D3)
J2: A-Headers (R17.2), FPGA (U1.A4)
LED1: A-Headers (R9.1), FPGA (U1.D14)
LED2: A-Headers (R10.1), FPGA (U1.C14)
PORT_A0: A-Headers (J1.1 J3.1), FPGA (U1.A2)
PORT_A1: A-Headers (J1.2 J3.3), FPGA (U1.C4)
PORT_A2: A-Headers (J1.3 J3.5), FPGA (U1.D4)
PORT_A3: A-Headers (J1.4 J3.7), FPGA (U1.A3)
PORT_A4: A-Headers (J3.2), FPGA (U1.B3)
PORT_A5: A-Headers (J3.4), FPGA (U1.C5)
PORT_A6: A-Headers (J3.6), FPGA (U1.E4)
PORT_A7: A-Headers (J3.8), FPGA (U1.C3)
PORT_B0: A-Headers (J1.6 J3.11), FPGA (U1.B2)
PORT_B1: A-Headers (J1.7 J3.13), FPGA (U1.C1)
PORT_B2: A-Headers (J1.8 J3.15), FPGA (U1.D2)
PORT_B3: A-Headers (J1.9 J3.17), FPGA (U1.F1)
PORT_B4: A-Headers (J3.12), FPGA (U1.B1)
PORT_B5: A-Headers (J3.14), FPGA (U1.D1)
PORT_B6: A-Headers (J3.16), FPGA (U1.E2)
PORT_B7: A-Headers (J3.18), FPGA (U1.G1)
PORT_C0: A-Headers (J1.11 J3.21), FPGA (U1.F3)
PORT_C1: A-Headers (J1.12 J3.23), FPGA (U1.F4)
PORT_C2: A-Headers (J1.13 J3.25), FPGA (U1.H3)
PORT_C3: A-Headers (J1.14 J3.27), FPGA (U1.J3)
PORT_C4: A-Headers (J3.22), FPGA (U1.F2)
PORT_C5: A-Headers (J3.24), FPGA (U1.G4)
PORT_C6: A-Headers (J3.26), FPGA (U1.H4)
PORT_C7: A-Headers (J3.28), FPGA (U1.J4)
PORT_D0: A-Headers (J1.16 J3.31), FPGA (U1.K3)
PORT_D1: A-Headers (J1.17 J3.33), FPGA (U1.L2)
PORT_D2: A-Headers (J1.18 J3.35), FPGA (U1.M2)
PORT_D3: A-Headers (J1.19 J3.37), FPGA (U1.M4)
PORT_D4: A-Headers (J3.32), FPGA (U1.K4)
PORT_D5: A-Headers (J3.34), FPGA (U1.L3)
PORT_D6: A-Headers (J3.36), FPGA (U1.M3)
PORT_D7: A-Headers (J3.38), FPGA (U1.M5)
PORT_E0: A-Headers (J2.16 J4.31), FPGA (U1.J12)
PORT_E1: A-Headers (J2.17 J4.33), FPGA (U1.M14)
PORT_E2: A-Headers (J2.18 J4.35), FPGA (U1.K12)
PORT_E3: A-Headers (J2.19 J4.37), FPGA (U1.M12)
PORT_E4: A-Headers (J4.32), FPGA (U1.J11)
PORT_E5: A-Headers (J4.34), FPGA (U1.N14)
PORT_E6: A-Headers (J4.36), FPGA (U1.K11)
PORT_E7: A-Headers (J4.38), FPGA (U1.M11)
PORT_F0: A-Headers (J2.11 J4.21), FPGA (U1.H13)
PORT_F1: A-Headers (J2.12 J4.23), FPGA (U1.J13)
PORT_F2: A-Headers (J2.13 J4.25), FPGA (U1.L12)
PORT_F3: A-Headers (J2.14 J4.27), FPGA (U1.L14)
PORT_F4: A-Headers (J4.22), FPGA (U1.H14)
PORT_F5: A-Headers (J4.24), FPGA (U1.J14)
PORT_F6: A-Headers (J4.26), FPGA (U1.L13)
PORT_F7: A-Headers (J4.28), FPGA (U1.M13)
PORT_G0: A-Headers (J2.6 J4.11), FPGA (U1.F14)
PORT_G1: A-Headers (J2.7 J4.13), FPGA (U1.E12)
PORT_G2: A-Headers (J2.8 J4.15), FPGA (U1.F11)
PORT_G3: A-Headers (J2.9 J4.17), FPGA (U1.H12)
PORT_G4: A-Headers (J4.12), FPGA (U1.G14)
PORT_G5: A-Headers (J4.14), FPGA (U1.F12)
PORT_G6: A-Headers (J4.16), FPGA (U1.G11)
PORT_G7: A-Headers (J4.18), FPGA (U1.H11)
PORT_H0: A-Headers (J2.1 J4.1), FPGA (U1.E11)
PORT_H1: A-Headers (J2.2 J4.3), FPGA (U1.C10)
PORT_H2: A-Headers (J2.3 J4.5), FPGA (U1.D12)
PORT_H3: A-Headers (J2.4 J4.7), FPGA (U1.E13)
PORT_H4: A-Headers (J4.2), FPGA (U1.C12)
PORT_H5: A-Headers (J4.4), FPGA (U1.D10)
PORT_H6: A-Headers (J4.6), FPGA (U1.D13)
PORT_H7: A-Headers (J4.8), FPGA (U1.F13)
PORT_TP0: A-Headers (TP1.1), FPGA (U1.H1)
PORT_TP1: A-Headers (TP2.1), FPGA (U1.H2)
PORT_TP2: A-Headers (TP3.1), FPGA (U1.J1)
PORT_TP3: A-Headers (TP4.1), FPGA (U1.J2)
PORT_TP4: A-Headers (TP5.1), FPGA (U1.L1)
PORT_TP5: A-Headers (TP6.1), FPGA (U1.M1)
PORT_TP6: A-Headers (TP10.1), FPGA (U1.B13)
PORT_TP7: A-Headers (TP11.1), FPGA (U1.B14)
RWDS: FPGA (U1.P4), Flash_RAM (U2.C3)
SPI_CS: FPGA (U1.C11), Flash_RAM (R19.2 U6.1)
SPI_MISO: FPGA (U1.B12), Flash_RAM (U6.2)
SPI_MOSI: FPGA (U1.B11), Flash_RAM (U6.5)
TCK: A-Headers (J10.3), FPGA_MISC (U1.A7)
TDI: A-Headers (J10.5), FPGA_MISC (U1.P7)
TDO: A-Headers (J10.4), FPGA_MISC (U1.P6)
TMS: A-Headers (J10.6), FPGA_MISC (U1.M6)

## Assembly variants
25-1C: not fitted J1 J2 J3 J4 J9 J10 J11 R5; alternate parts D3 -> 28262, D2 -> 28262